# EAGLE design Shield_LevelShifter_DIP (EAGLE 9.4.2)
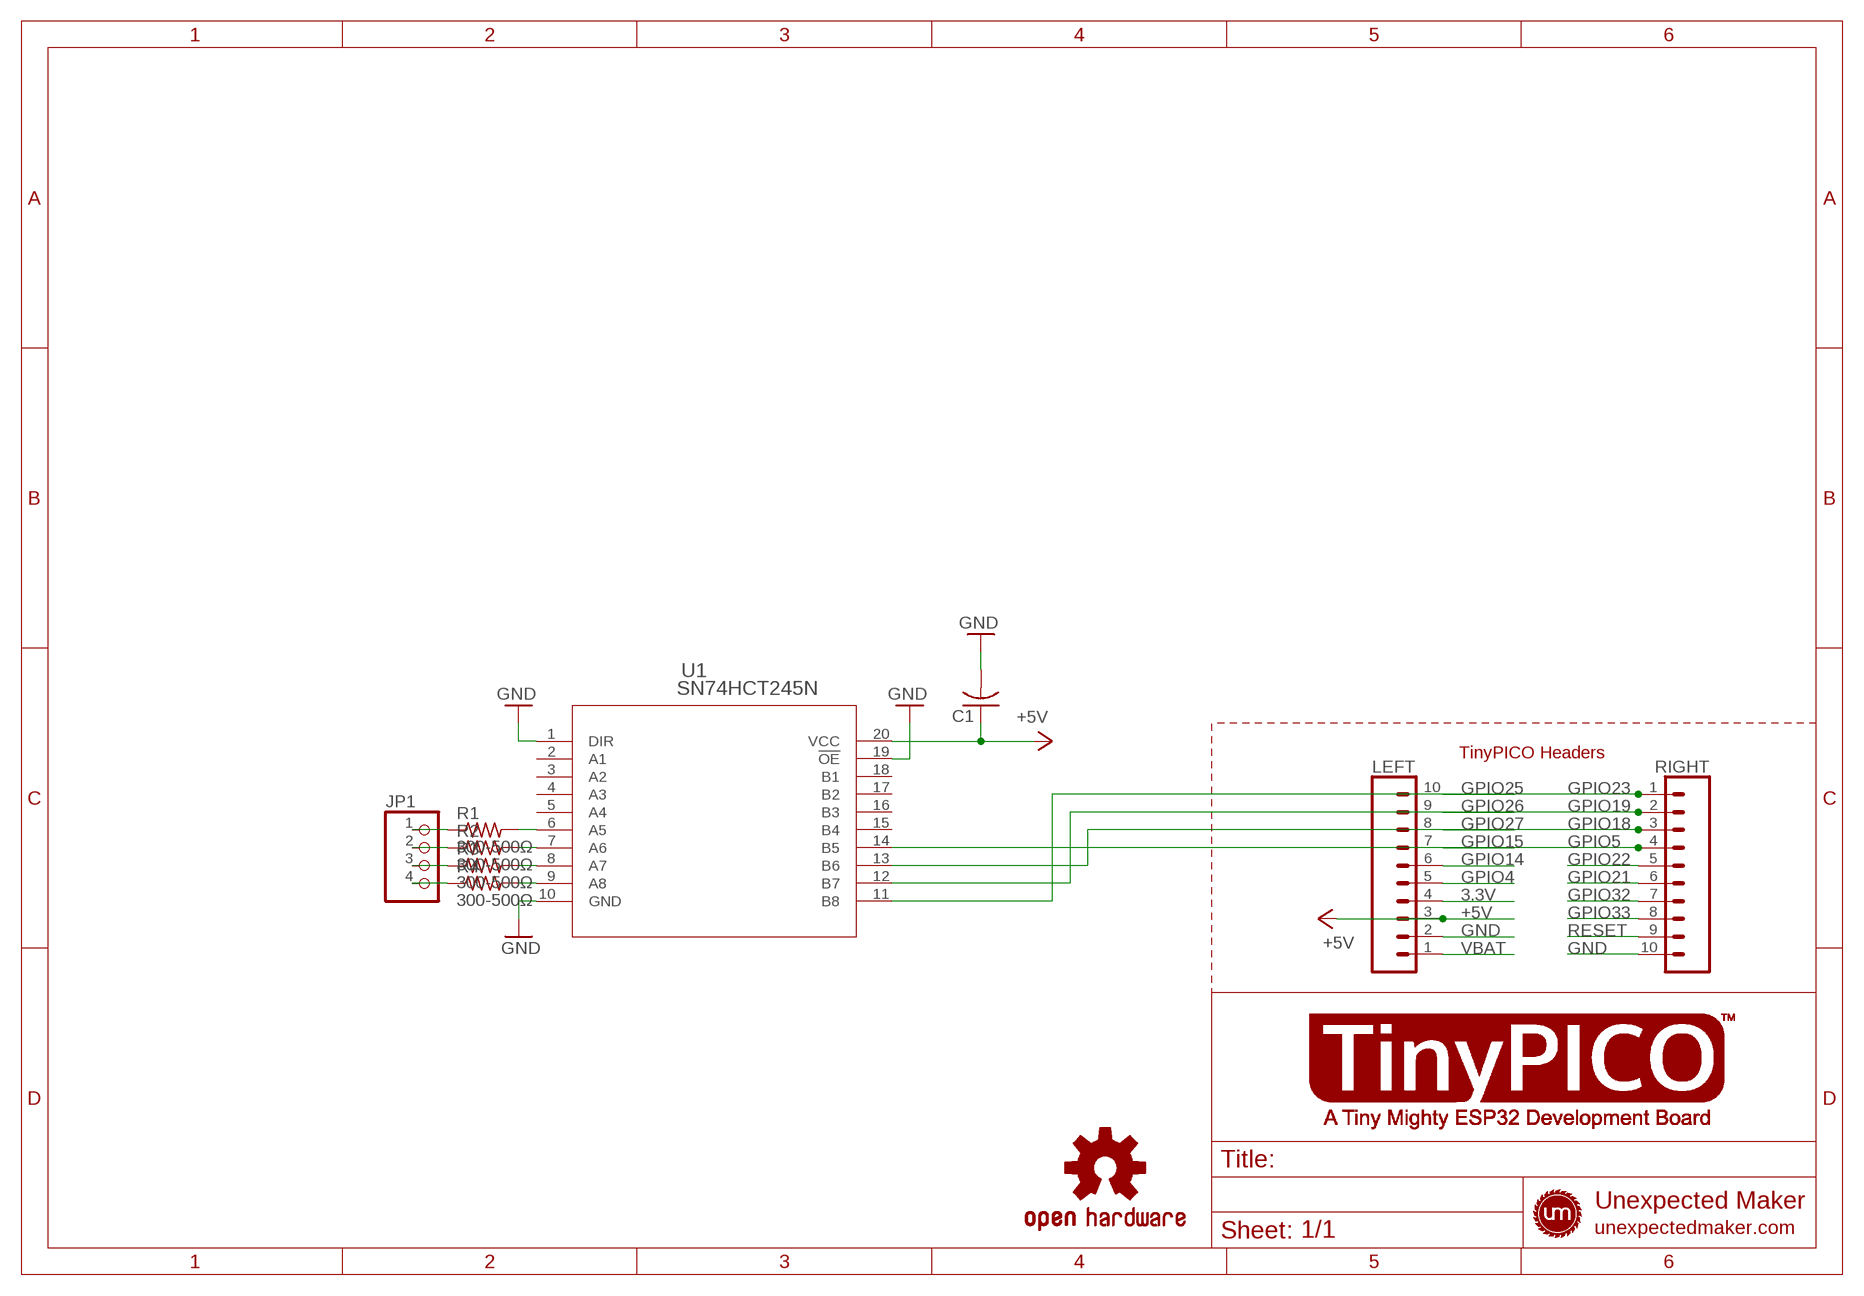
[diagram p0: schematic, sheet 1]

## Parts
C1  C-US025-025X050  [C025-025X050]
JP1  PINHD-1X4  [1X04]
LEFT  TINYPICO_HEADER_10NO_SILK_PTH_FEMALE  [1X10_NO_SILK]
LOGO1  OSHW-LOGOS  [OSHW-LOGO-S]
R1  300-500Ω  R-US_0204/2V  [0204V]
R2  300-500Ω  R-US_0204/2V  [0204V]
R3  300-500Ω  R-US_0204/2V  [0204V]
R4  300-500Ω  R-US_0204/2V  [0204V]
RIGHT  TINYPICO_HEADER_10NO_SILK_PTH_FEMALE  [1X10_NO_SILK]
U1  SN74HCT245N  [N20]

## Nets
3.3V: LEFT.4
+5V: C1.1 LEFT.3 U1.20(VCC)
GND: C1.2 LEFT.2 RIGHT.10 U1.1(DIR) U1.10(GND) U1.19(!OE)
GPIO4: LEFT.5
GPIO5: RIGHT.4 U1.14(B5)
GPIO14: LEFT.6
GPIO15: LEFT.7
GPIO18: RIGHT.3 U1.13(B6)
GPIO19: RIGHT.2 U1.12(B7)
GPIO21: RIGHT.6
GPIO22: RIGHT.5
GPIO23: RIGHT.1 U1.11(B8)
GPIO25: LEFT.10
GPIO26: LEFT.9
GPIO27: LEFT.8
GPIO32: RIGHT.7
GPIO33: RIGHT.8
N$2: R1.2 U1.6(A5)
N$3: R2.2 U1.7(A6)
N$4: R3.2 U1.8(A7)
N$5: R4.2 U1.9(A8)
N$10: JP1.1 R1.1
N$11: JP1.2 R2.1
N$12: JP1.3 R3.1
N$13: JP1.4 R4.1
RESET: RIGHT.9
VBAT: LEFT.1
Unconnected: U1.2(A1) U1.3(A2) U1.4(A3) U1.5(A4) U1.15(B4) U1.16(B3) U1.17(B2) U1.18(B1)

## Notes on the sheet
- TinyPICO Headers

## Library data of the parts
C1 = rcl:C-US: CAPACITOR, American symbol; SPICEPREFIX: C
JP1 = pinhead:PINHD-1X4: PIN HEADER
LEFT RIGHT = UnexpectedMaker:TINYPICO_HEADER_10: Multi connection point. Often used as Generic Header-pin footprint for 0.1 inch spaced/style header connections On any of the 0.1 inch spaced packages, you can populate with these: Break Away Headers - Straight <https://www.sparkfun.com/products/116> (PRT-00116) Break Away Male Headers - Right Angle <https://www.sparkfun.com/products/553> (PRT-00553) Female Headers <https://www.sparkfun.com/products/115> (PRT-00115) Break Away Headers - Machine Pin <https://www.sparkfun.com/products/117> (PRT-00117) Break Away Female Headers - Swiss Machine Pin <https://www.sparkfun.com/products/743> (PRT-00743) Arduino Stackable Header - 10 Pin <https://www.sparkfun.com/products/11376> (PRT-11376) For SCREWTERMINALS and SPRING TERMINALS visit here: Screw Terimnals on SparkFun.com <https://www.sparkfun.com/search/results?term=Screw+Terminals> (5mm/3.5mm/2.54mm spacing) This device is also useful as a general connection point to wire up your design to another part of your project. Our various solder wires solder well into these plated through hole pads. Hook-Up Wire - Assortment (Stranded, 22 AWG) <https://www.sparkfun.com/products/11375> (PRT-11375) Hook-Up Wire - Assortment (Solid Core, 22 AWG) <https://www.sparkfun.com/products/11367> (PRT-11367) View the entire wire category on our website here <https://www.sparkfun.com/categories/141> Special notes: Molex polarized connector foot print use with SKU : PRT-08231 with associated crimp pins and housings. 1MM SMD Version SKU: PRT-10208 NOTES ON THE VARIANTS LOCK and LOCK_LONGPADS... This footprint was designed to help hold the alignment of a through-hole component (i.e. 6-pin header) while soldering it into place. You may notice that each hole has been shifted either up or down by 0.005 of an inch from it's more standard position (which is a perfectly straight line). This slight alteration caused the pins (the squares in the middle) to touch the edges of the holes. Because they are alternating, it causes a "brace" to hold the component in place. 0.005 has proven to be the perfect amount of "off-center" position when using our standard breakaway headers. Although looks a little odd when you look at the bare footprint, once you have a header in there, the alteration is very hard to notice. Also,if you push a header all the way into place, it is covered up entirely on the bottom side.; PROD_ID: CONN-11563
LOGO1 = SparkFun-Aesthetics:OSHW-LOGO: Open-Source Hardware (OSHW) Logo This logo indicates the piece of hardware it is found on incorporates a OSHW license and/or adheres to the definition of open source hardware found here: http://freedomdefined.org/OSHW
R1-R4 = rcl:R-US_: RESISTOR, American symbol; SPICEPREFIX: R
U1 = SN74HCT245:SN74HCT245N; MANUFACTURER_PART_NUMBER: SN74HCT245N; VENDOR: Texas Instruments

## Board
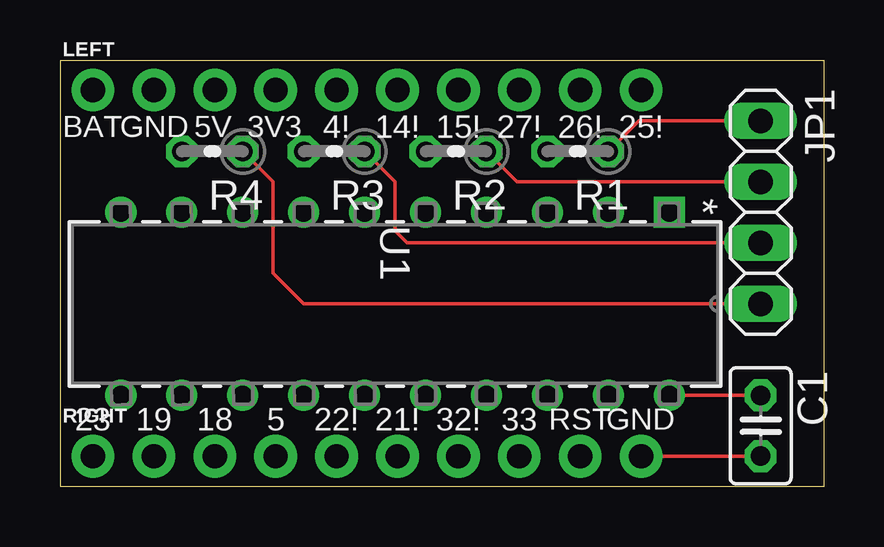
[diagram p1: board, top side]
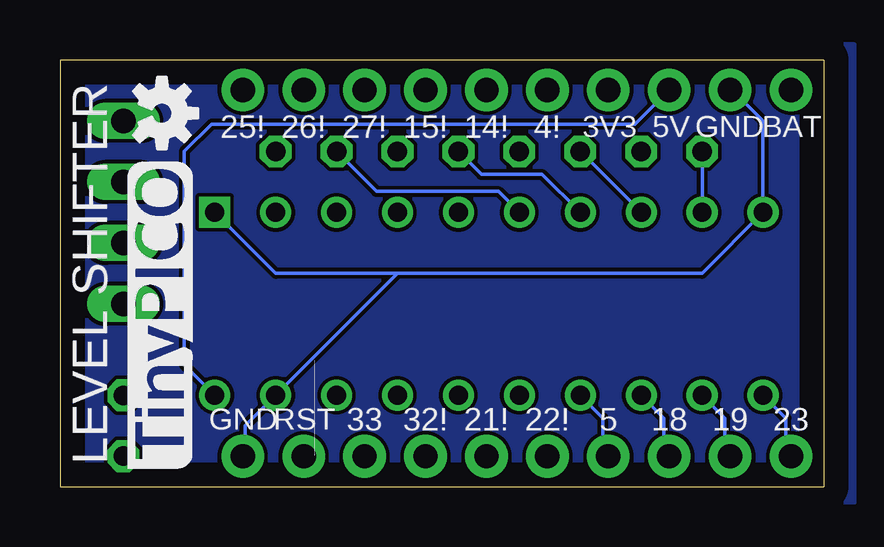
[diagram p2: board, bottom side, seen from below]

Size 31.85 x 17.78 mm. Coordinates in mm from the lower left corner, seen from the top.
Outline: 31.85,0 0,0 0,17.78 31.85,17.78 31.85,0
Copper layers (1*16): Top 0.035mm / dielectric 1.5mm / Bottom 0.035mm
Design rules "default": minimum track width 6mil, minimum drill 0.35mm, track to track 6mil, track to pad 6mil, pad to pad 6mil, via to via 6mil, smd to smd 6mil, copper to edge 40mil, drill to drill 6mil, minimum pad ring 10mil, minimum via ring 8mil, stop-mask expansion 4mil, vias tented up to drill 0mil, thermal gap 10mil

### Footprints (pad centres in the part's own frame; a part is rotated, then mirrored left to right if it is on the bottom)
C025-025X050 = drill 0.813 octagon: 1 -1.27,0; 2 1.27,0
1X04 = drill 1.016 long: 1 -3.81,0; 2 -1.27,0; 3 1.27,0; 4 3.81,0
1X10_NO_SILK = drill 1.016 pad 1.778: 1 0,0; 2 2.54,0; 3 5.08,0; 4 7.62,0; 5 10.16,0; 6 12.7,0; 7 15.24,0; 8 17.78,0; 9 20.32,0; 10 22.86,0
0204V = drill 0.813 octagon: 1 -1.27,0; 2 1.27,0
N20 = drill 0.787 pad 1.295 square: 1 -7.62,22.86 | drill 0.787 pad 1.295: 2 -7.62,20.32; 3 -7.62,17.78; 4 -7.62,15.24; 5 -7.62,12.7; 6 -7.62,10.16; 7 -7.62,7.62; 8 -7.62,5.08; 9 -7.62,2.54; 10 -7.62,0; 11 0,0; 12 0,2.54; 13 0,5.08; 14 0,7.62; 15 0,10.16; 16 0,12.7; 17 0,15.24; 18 0,17.78; 19 0,20.32; 20 0,22.86

### Placement (x,y rotation side)
C1  29.21,2.54 270 top
JP1  29.21,11.43 270 top
LEFT  1.37,16.54 0 top
LOGO1  27.6,15.56 270 bottom
R1  300  [0204V]  21.59,13.97 180 top
R2  300  [0204V]  16.51,13.97 180 top
R3  300  [0204V]  11.43,13.97 180 top
R4  300  [0204V]  6.35,13.97 180 top
RIGHT  1.37,1.27 0 top
U1  2.54,3.81 270 top

### Tracks (layer width: path | path; a pad name or v marks a point on that pad's centre or on a via)
+5V
  Top 0.152: C1.1 U1.20
  Bottom 0.152: 6.67,16.51 LEFT.3 7.87,15.11 25.53,15.11 26.67,13.97 26.67,5.08 U1.20
GND
  Top 0.152: RIGHT.10 C1.2
  Bottom 0.152: RIGHT.10 24.13,1.27 24.13,2.54 U1.19 17.78,8.89 | U1.1 22.86,8.89 17.78,8.89 | LEFT.2 3.89,16.51 3.81,16.51 2.54,15.24 U1.10 5.08,8.89 17.78,8.89
GND1
  pour Bottom: 32.38,18.41 32.38,-0.64 -1.27,-0.64 -1.27,18.41
GPIO5
  Bottom 0.152: U1.14 9.21,2.86 9.21,1.27 RIGHT.4
GPIO18
  Bottom 0.152: U1.13 6.67,2.86 6.67,1.27 RIGHT.3
GPIO19
  Bottom 0.152: U1.12 4.13,2.86 4.13,1.27 RIGHT.2
GPIO23
  Bottom 0.152: U1.11 1.59,2.86 1.59,1.27 RIGHT.1
N$2
  Bottom 0.152: U1.6 13.58,12.31 18.66,12.31 R1.2
N$3
  Bottom 0.152: U1.7 11.75,13.02 14.29,13.02 R2.2
N$4
  Bottom 0.152: U1.8 R3.2
N$5
  Bottom 0.152: U1.9 R4.2
N$10
  Top 0.152: R1.1 24.13,15.24 JP1.1
N$11
  Top 0.152: R2.1 19.05,12.7 JP1.2
N$12
  Top 0.152: JP1.3 14.48,10.16 13.97,10.67 13.97,12.7 R3.1
N$13
  Top 0.152: JP1.4 10.16,7.62 8.89,8.89 8.89,12.7 R4.1

### Text on the board
bPlace: LEVEL SHIFTER
tNames: BAT | GND | 5V | 3V3 | 4! | 14! | 15! | 27! | 26! | 25! | 23 | 19 | 18 | 5 | 22! | 21! | 32! | 33 | RST | GND
bNames: BAT | GND | 5V | 3V3 | 4! | 14! | 15! | 27! | 26! | 25! | 23 | 19 | 18 | 5 | 22! | 21! | 32! | 33 | RST | GND